# EAGLE schematic PBC-2 (EAGLE 7.1.0)
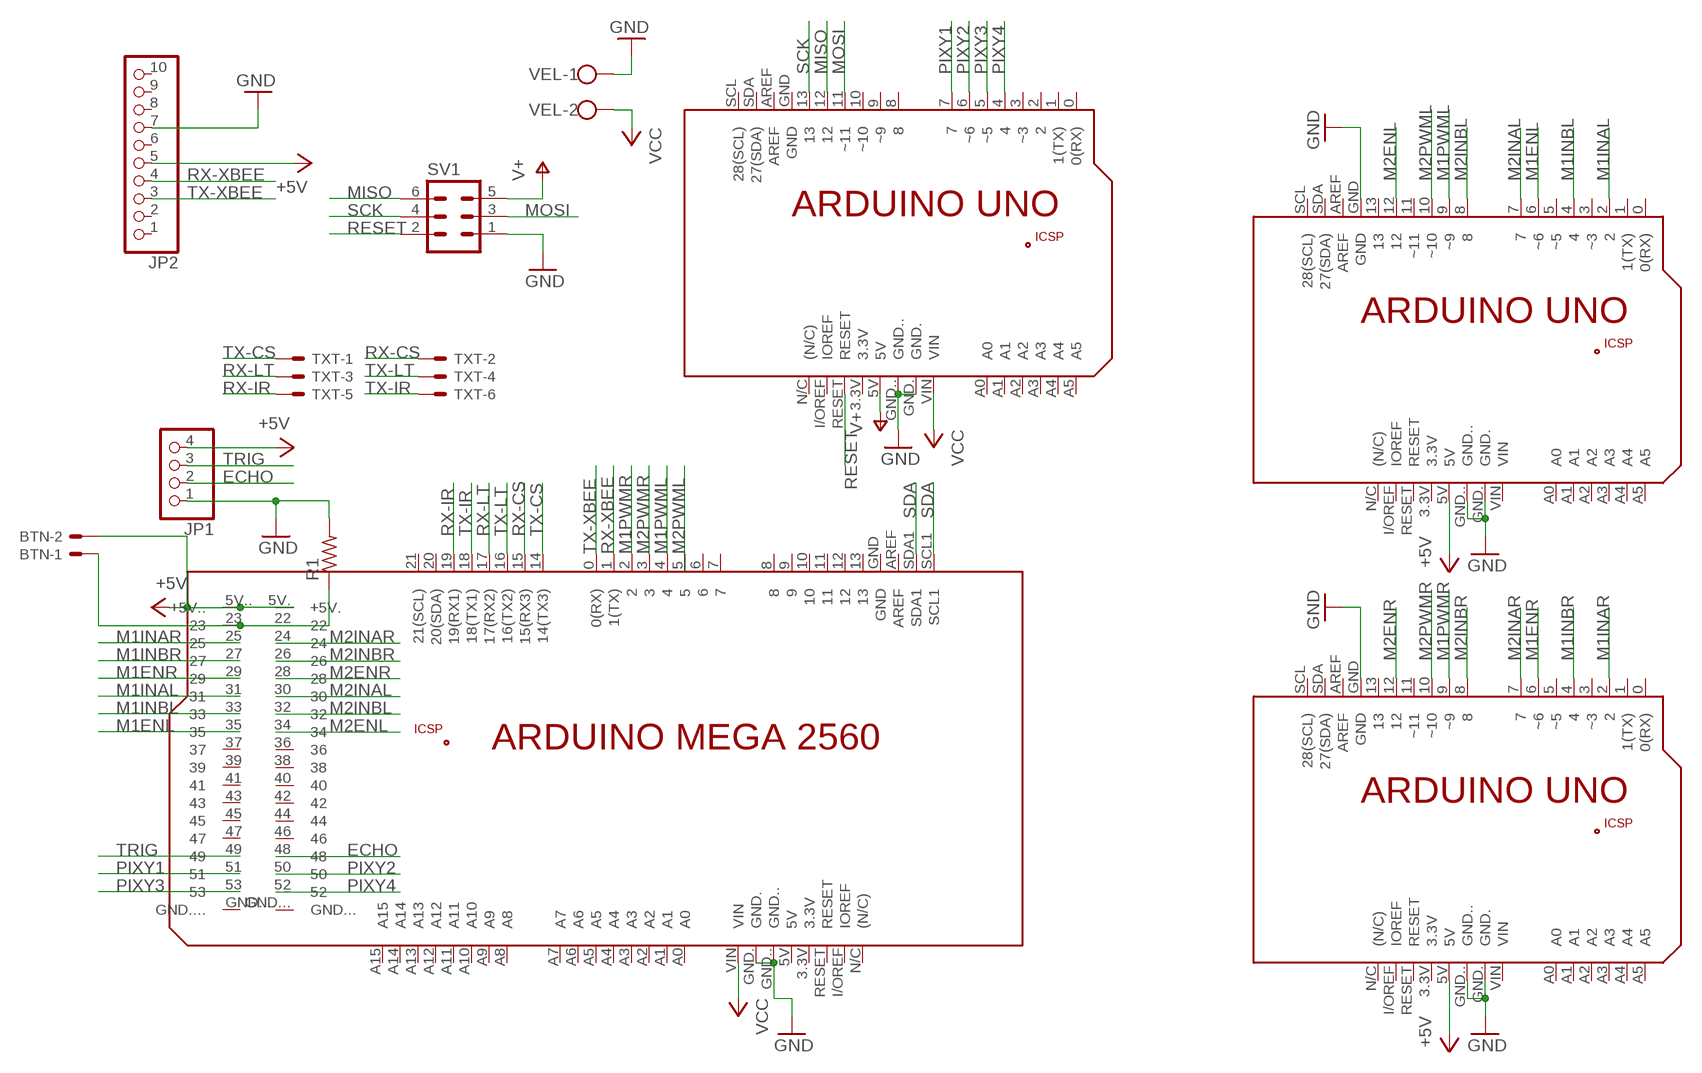
[diagram p0: schematic, sheet 1]

## Parts
BTN  22-23-2021  [22-23-2021]
JP1  PINHD-1X4  [1X04]
JP2  PINHD-1X10  [1X10]
MEGA  ARDUINO_MEGA2560  [ARDUINO_MEGA2560]
PUENTE1  ARDUINO_UNO  [ARDUINO_UNO]
PUENTE2  ARDUINO_UNO  [ARDUINO_UNO]
R1  R-US_0204/5  [0204/5]
SV1  MA03-2  [MA03-2]
TXT  87758-0616  [87758-0616]
UNO  ARDUINO_UNO  [ARDUINO_UNO]
VEL  W237-102  [W237-102]

## Nets
+5V: BTN.2 JP1.4 JP2.5 MEGA.5V..(+5V..) PUENTE1.5V PUENTE2.5V
ECHO: JP1.2 MEGA.48
GND: JP1.1 JP2.7 MEGA.GND. MEGA.GND.. PUENTE1.GND PUENTE1.GND. PUENTE1.GND.. PUENTE2.GND PUENTE2.GND. PUENTE2.GND.. R1.2 SV1.1 UNO.GND. UNO.GND.. VEL.1
M1ENL: MEGA.35 PUENTE2.6(~6)
M1ENR: MEGA.29 PUENTE1.6(~6)
M1INAL: MEGA.31 PUENTE2.2
M1INAR: MEGA.25 PUENTE1.2
M1INBL: MEGA.33 PUENTE2.4
M1INBR: MEGA.27 PUENTE1.4
M1PWML: MEGA.4 PUENTE2.9(~9)
M1PWMR: MEGA.2 PUENTE1.9(~9)
M2ENL: MEGA.34 PUENTE2.12
M2ENR: MEGA.28 PUENTE1.12
M2INAL: MEGA.30 PUENTE2.7
M2INAR: MEGA.24 PUENTE1.7
M2INBL: MEGA.32 PUENTE2.8
M2INBR: MEGA.26 PUENTE1.8
M2PWML: PUENTE2.10(~10)
M2PWMR: MEGA.3 PUENTE1.10(~10)
MISO: SV1.6 UNO.12
MOSI: SV1.3 UNO.11(~11)
N$1: BTN.1 MEGA.23 R1.1
PIXY1: MEGA.51 UNO.7
PIXY2: MEGA.50 UNO.6(~6)
PIXY3: MEGA.53 UNO.5(~5)
PIXY4: MEGA.52 UNO.4
RESET: SV1.2 UNO.RESET
RX-CS: MEGA.15(15(RX3)) TXT.2
RX-IR: MEGA.19(19(RX1)) TXT.5
RX-LT: MEGA.17(17(RX2)) TXT.3
RX-XBEE: JP2.4 MEGA.1(1(TX))
SCK: SV1.4 UNO.13
SCL: MEGA.SCL1
SDA: MEGA.SDA1
TRIG: JP1.3 MEGA.49
TX-CS: MEGA.14(14(TX3)) TXT.1
TX-IR: MEGA.18(18(TX1)) TXT.6
TX-LT: MEGA.16(16(TX2)) TXT.4
TX-XBEE: JP2.3 MEGA.0(0(RX))
V+: SV1.5 UNO.5V
VCC: MEGA.VIN UNO.VIN VEL.2
Unconnected: JP2.1 JP2.2 JP2.6 JP2.8 JP2.9 JP2.10 MEGA.3.3V MEGA.5 MEGA.5V MEGA.5V.(+5V.) MEGA.6 MEGA.7 MEGA.8 MEGA.9 MEGA.10 MEGA.11 MEGA.12 MEGA.13 MEGA.20(20(SDA)) MEGA.21(21(SCL)) MEGA.22 MEGA.36 MEGA.37 MEGA.38 MEGA.39 MEGA.40 MEGA.41 MEGA.42 MEGA.43 MEGA.44 MEGA.45 MEGA.46 MEGA.47 MEGA.+5V_ MEGA.A0 MEGA.A1 MEGA.A2 MEGA.A3 MEGA.A4 MEGA.A5 MEGA.A6 MEGA.A7 MEGA.A8 MEGA.A9 MEGA.A10 MEGA.A11 MEGA.A12 MEGA.A13 MEGA.A14 MEGA.A15 MEGA.AREF MEGA.GND MEGA.GND... MEGA.GND.... MEGA.GND__ MEGA.I/OREF(IOREF) MEGA.MISO MEGA.MOSI MEGA.N/C((N/C)) MEGA.RESET MEGA.RESET. MEGA.SCK PUENTE1.0(0(RX)) PUENTE1.1(1(TX)) PUENTE1.3(~3) PUENTE1.3.3V PUENTE1.5(~5) PUENTE1.11(~11) PUENTE1.13 PUENTE1.+5V PUENTE1.A0 PUENTE1.A1 PUENTE1.A2 PUENTE1.A3 PUENTE1.A4 PUENTE1.A5 PUENTE1.AREF PUENTE1.GND_ PUENTE1.I/OREF(IOREF) PUENTE1.MISO PUENTE1.MOSI PUENTE1.N/C((N/C)) PUENTE1.RESET PUENTE1.RESET. PUENTE1.SCK PUENTE1.SCL(28(SCL)) PUENTE1.SDA(27(SDA)) PUENTE1.VIN PUENTE2.0(0(RX)) PUENTE2.1(1(TX)) PUENTE2.3(~3) PUENTE2.3.3V PUENTE2.5(~5) PUENTE2.11(~11) PUENTE2.13 PUENTE2.+5V PUENTE2.A0 PUENTE2.A1 PUENTE2.A2 PUENTE2.A3 PUENTE2.A4 PUENTE2.A5 PUENTE2.AREF PUENTE2.GND_ PUENTE2.I/OREF(IOREF) PUENTE2.MISO PUENTE2.MOSI PUENTE2.N/C((N/C)) PUENTE2.RESET PUENTE2.RESET. PUENTE2.SCK PUENTE2.SCL(28(SCL)) PUENTE2.SDA(27(SDA)) PUENTE2.VIN UNO.0(0(RX)) UNO.1(1(TX)) UNO.2 UNO.3(~3) UNO.3.3V UNO.8 UNO.9(~9) UNO.10(~10) UNO.+5V UNO.A0 UNO.A1 UNO.A2 UNO.A3 UNO.A4 UNO.A5 UNO.AREF UNO.GND UNO.GND_ UNO.I/OREF(IOREF) UNO.MISO UNO.MOSI UNO.N/C((N/C)) UNO.RESET. UNO.SCK UNO.SCL(28(SCL)) UNO.SDA(27(SDA))

## Library data of the parts
BTN = con-molex:22-23-2021: .100" (2.54mm) Center Header - 2 Pin; MF: MOLEX; MPN: 22-23-2021; OC_FARNELL: 1462926; OC_NEWARK: 25C3832
JP1 = pinhead:PINHD-1X4: PIN HEADER
JP2 = pinhead:PINHD-1X10: PIN HEADER
MEGA = E14_Arduino_revB:ARDUINO_MEGA2560: Device for representing an Arduino Mega 2560 board with a footprint in an EAGLE design. Created by Dave Young for Element14. More EAGLE documentation at: http://www.element14.com/community/community/knode/cadsoft_eagle
PUENTE1 PUENTE2 UNO = E14_Arduino_revB:ARDUINO_UNO: Device for representing an Arduino Uno board with a footprint in an EAGLE design. Created by Dave Young for Element14. More EAGLE documentation at: http://www.element14.com/community/community/knode/cadsoft_eagle
R1 = rcl:R-US_: RESISTOR, American symbol
SV1 = con-lstb:MA03-2: PIN HEADER; OC_FARNELL: unknown; OC_NEWARK: unknown
TXT = con-molex:87758-0616: 6 Pin - 2mm Dual Row Single Wafer, Vertical T/H HDR Source: http://www.molex.com/pdm_docs/sd/877580616_sd.pdf; MPN: 87758-0616; OC_FARNELL: 7472323; OC_NEWARK: 25M5667
VEL = con-wago-500:W237-102: WAGO SCREW CLAMP; MPN: 237-102; OC_FARNELL: unknown; OC_NEWARK: 70K9898